# EAGLE schematic Regulauta (EAGLE 7.7.0)
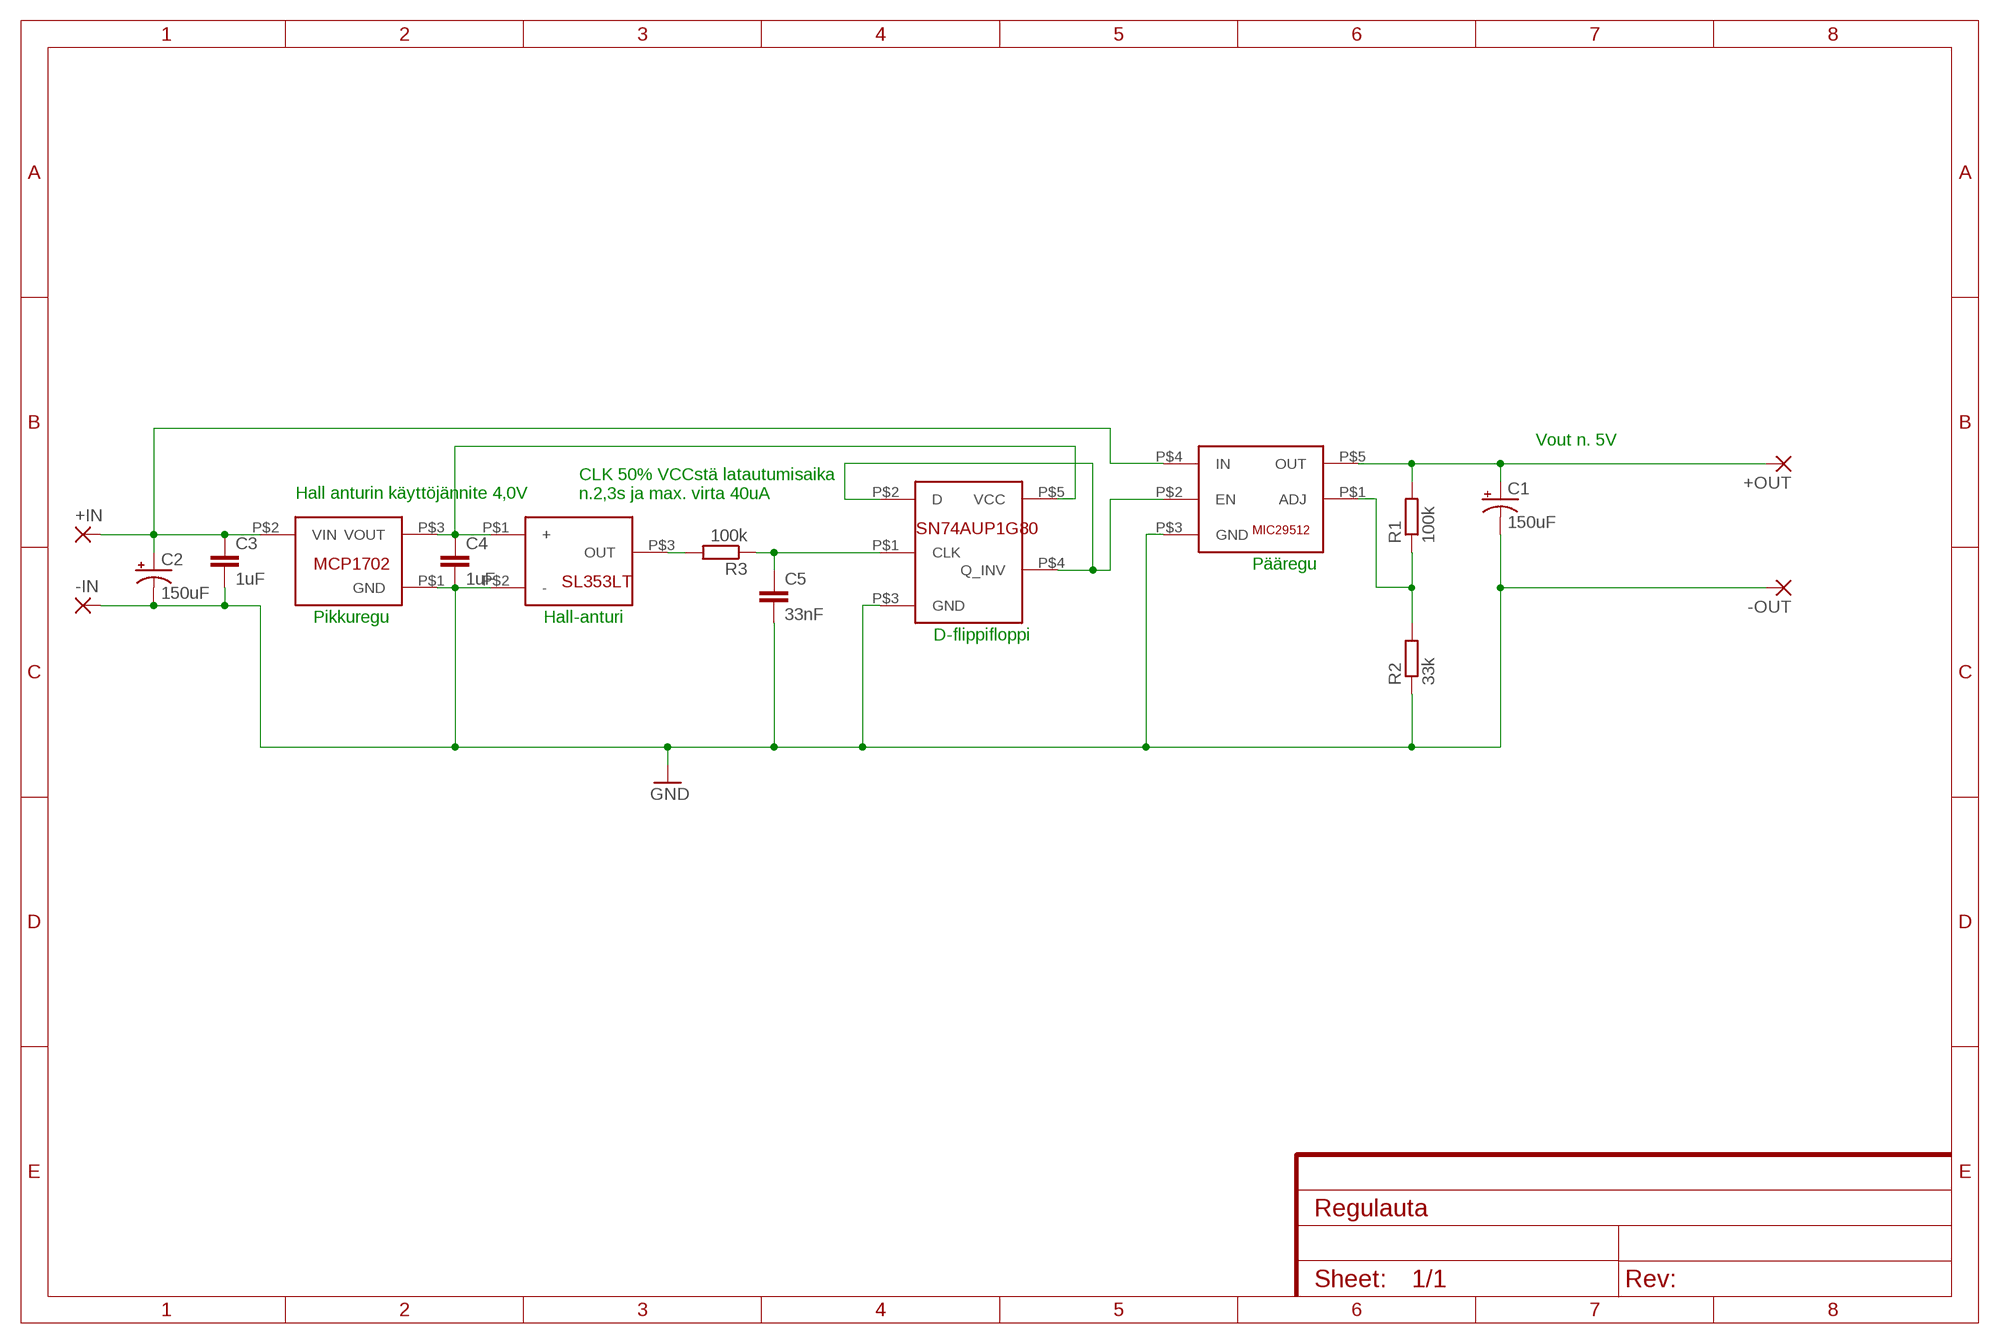
[diagram p0: schematic, sheet 1]

## Parts
+IN  SMD5  [SMD2,54-5,08]
+OUT  SMD5  [SMD2,54-5,08]
-IN  SMD5  [SMD2,54-5,08]
-OUT  SMD5  [SMD2,54-5,08]
C1  150uF  CAP_POLPTH1  [CPOL-RADIAL-100UF-25V]
C2  150uF  CAP_POLPTH1  [CPOL-RADIAL-100UF-25V]
C3  1uF  CAP1206  [1206]
C4  1uF  CAP1206  [1206]
C5  33nF  CAP1206  [1206]
R1  100k  R-EU_R1206  [R1206]
R2  33k  R-EU_R1206  [R1206]
R3  100k  R-EU_R1206  [R1206]
U$1  SL353LT  [SL353LT]
U$2  MIC29512  [MIC29512]
U$3  SN74AUP1G80  [SN74AUP1G80]
U$4  MCP1702  [SL353LT]

## Nets
GND: -IN.1(P) -OUT.1(P) C1.2(-) C2.2(-) C3.2 C4.2 C5.2 R2.1 U$1.P$2(-) U$2.P$3(GND) U$3.P$3(GND) U$4.P$1(GND)
N$1: +IN.1(P) C2.1(+) C3.1 U$2.P$4(IN) U$4.P$2(VIN)
N$2: R3.2 U$1.P$3(OUT)
N$4: C4.1 U$1.P$1(+) U$3.P$5(VCC) U$4.P$3(VOUT)
N$5: R1.1 R2.2 U$2.P$1(ADJ)
N$6: +OUT.1(P) C1.1(+) R1.2 U$2.P$5(OUT)
N$7: C5.1 R3.1 U$3.P$1(CLK)
N$8: U$2.P$2(EN) U$3.P$2(D) U$3.P$4(Q_INV)

## Notes on the sheet
- Vout n. 5V
- Hall anturin käyttöjännite 4,0V
- CLK 50% VCCstä latautumisaika
  n.2,3s ja max. virta 40uA
- Pääregu
- Pikkuregu | Hall-anturi
- D-flippifloppi

## Library data of the parts
+IN +OUT -IN -OUT = wirepad:SMD5: SMD PAD
C1 C2 = SparkFun-Capacitors:CAP_POL: Capacitor Polarized These are standard SMD and PTH capacitors. Normally 10uF, 47uF, and 100uF in electrolytic and tantalum varieties. Always verify the external diameter of the through hole cap, it varies with capacity, voltage, and manufacturer. The EIA devices should be standard.
C3-C5 = SparkFun-Capacitors:CAP: Capacitor Standard 0603 ceramic capacitor, and 0.1" leaded capacitor.
R1-R3 = resistor:R-EU_: RESISTOR, European symbol
U$1 = Oma_kirjasto:SL353LT
U$2 = Oma_kirjasto:MIC29512
U$3 = Oma_kirjasto:SN74AUP1G80
U$4 = Oma_kirjasto:MCP1702